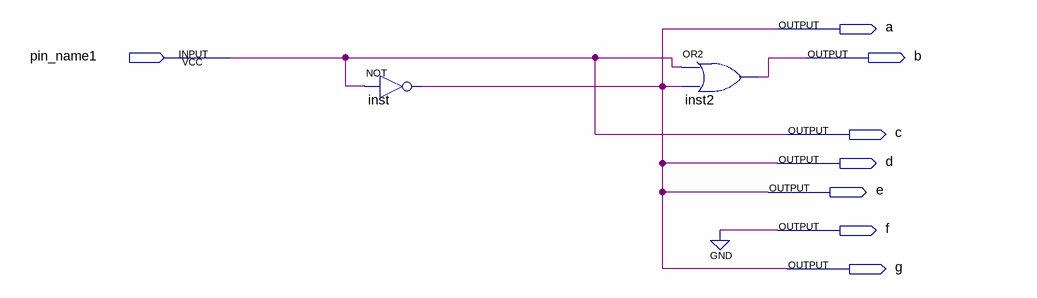
[diagram p0: schematic sheet]
// Quartus schematic player_change.bdf as structural Verilog: 2 symbols, 8 pins
module player_change (
  input  pin_name1,
  output a,
  output b,
  output c,
  output d,
  output e,
  output f,
  output g
);

  not inst (a, pin_name1);
  or inst2 (b, pin_name1, a);

  assign c = pin_name1;
  assign d = a;
  assign e = a;
  assign f = 1'b0;
  assign g = a;
endmodule
